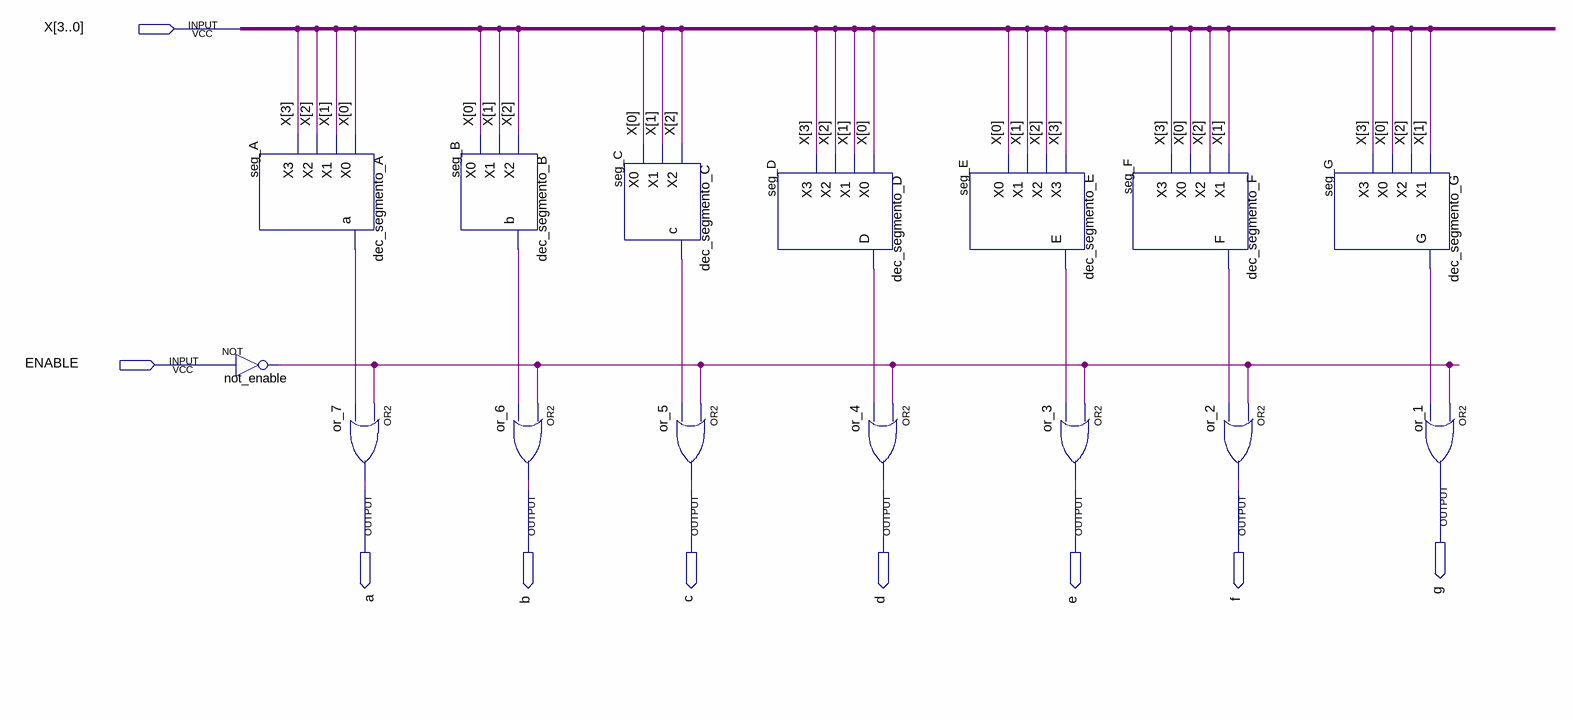
[diagram p0: schematic sheet]
// Quartus schematic dec_7_segmentos.bdf as structural Verilog: 15 symbols, 9 pins
module dec_7_segmentos (
  input  [3:0] X,
  input  ENABLE,
  output g,
  output a,
  output b,
  output c,
  output d,
  output e,
  output f
);

  wire not_enable_out, seg_A_a, seg_B_b, seg_C_c, seg_D_d, seg_E_e, seg_F_f, seg_G_g;

  dec_segmento_A seg_A (.X0(X[0]), .X1(X[1]), .X2(X[2]), .X3(X[3]), .a(seg_A_a));
  not not_enable (not_enable_out, ENABLE);
  or or_7 (a, not_enable_out, seg_A_a);
  dec_segmento_B seg_B (.X2(X[2]), .X1(X[1]), .X0(X[0]), .b(seg_B_b));
  or or_6 (b, not_enable_out, seg_B_b);
  dec_segmento_C seg_C (.X2(X[2]), .X1(X[1]), .X0(X[0]), .c(seg_C_c));
  or or_5 (c, not_enable_out, seg_C_c);
  dec_segmento_D seg_D (.X0(X[0]), .X1(X[1]), .X2(X[2]), .X3(X[3]), .D(seg_D_d));
  or or_4 (d, not_enable_out, seg_D_d);
  dec_segmento_E seg_E (.X3(X[3]), .X2(X[2]), .X1(X[1]), .X0(X[0]), .E(seg_E_e));
  or or_3 (e, not_enable_out, seg_E_e);
  dec_segmento_F seg_F (.X1(X[1]), .X2(X[2]), .X0(X[0]), .X3(X[3]), .F(seg_F_f));
  or or_2 (f, not_enable_out, seg_F_f);
  dec_segmento_G seg_G (.X1(X[1]), .X2(X[2]), .X0(X[0]), .X3(X[3]), .G(seg_G_g));
  or or_1 (g, not_enable_out, seg_G_g);
endmodule
